# EAGLE design MainboardESP8266 (EAGLE 7.7.0)
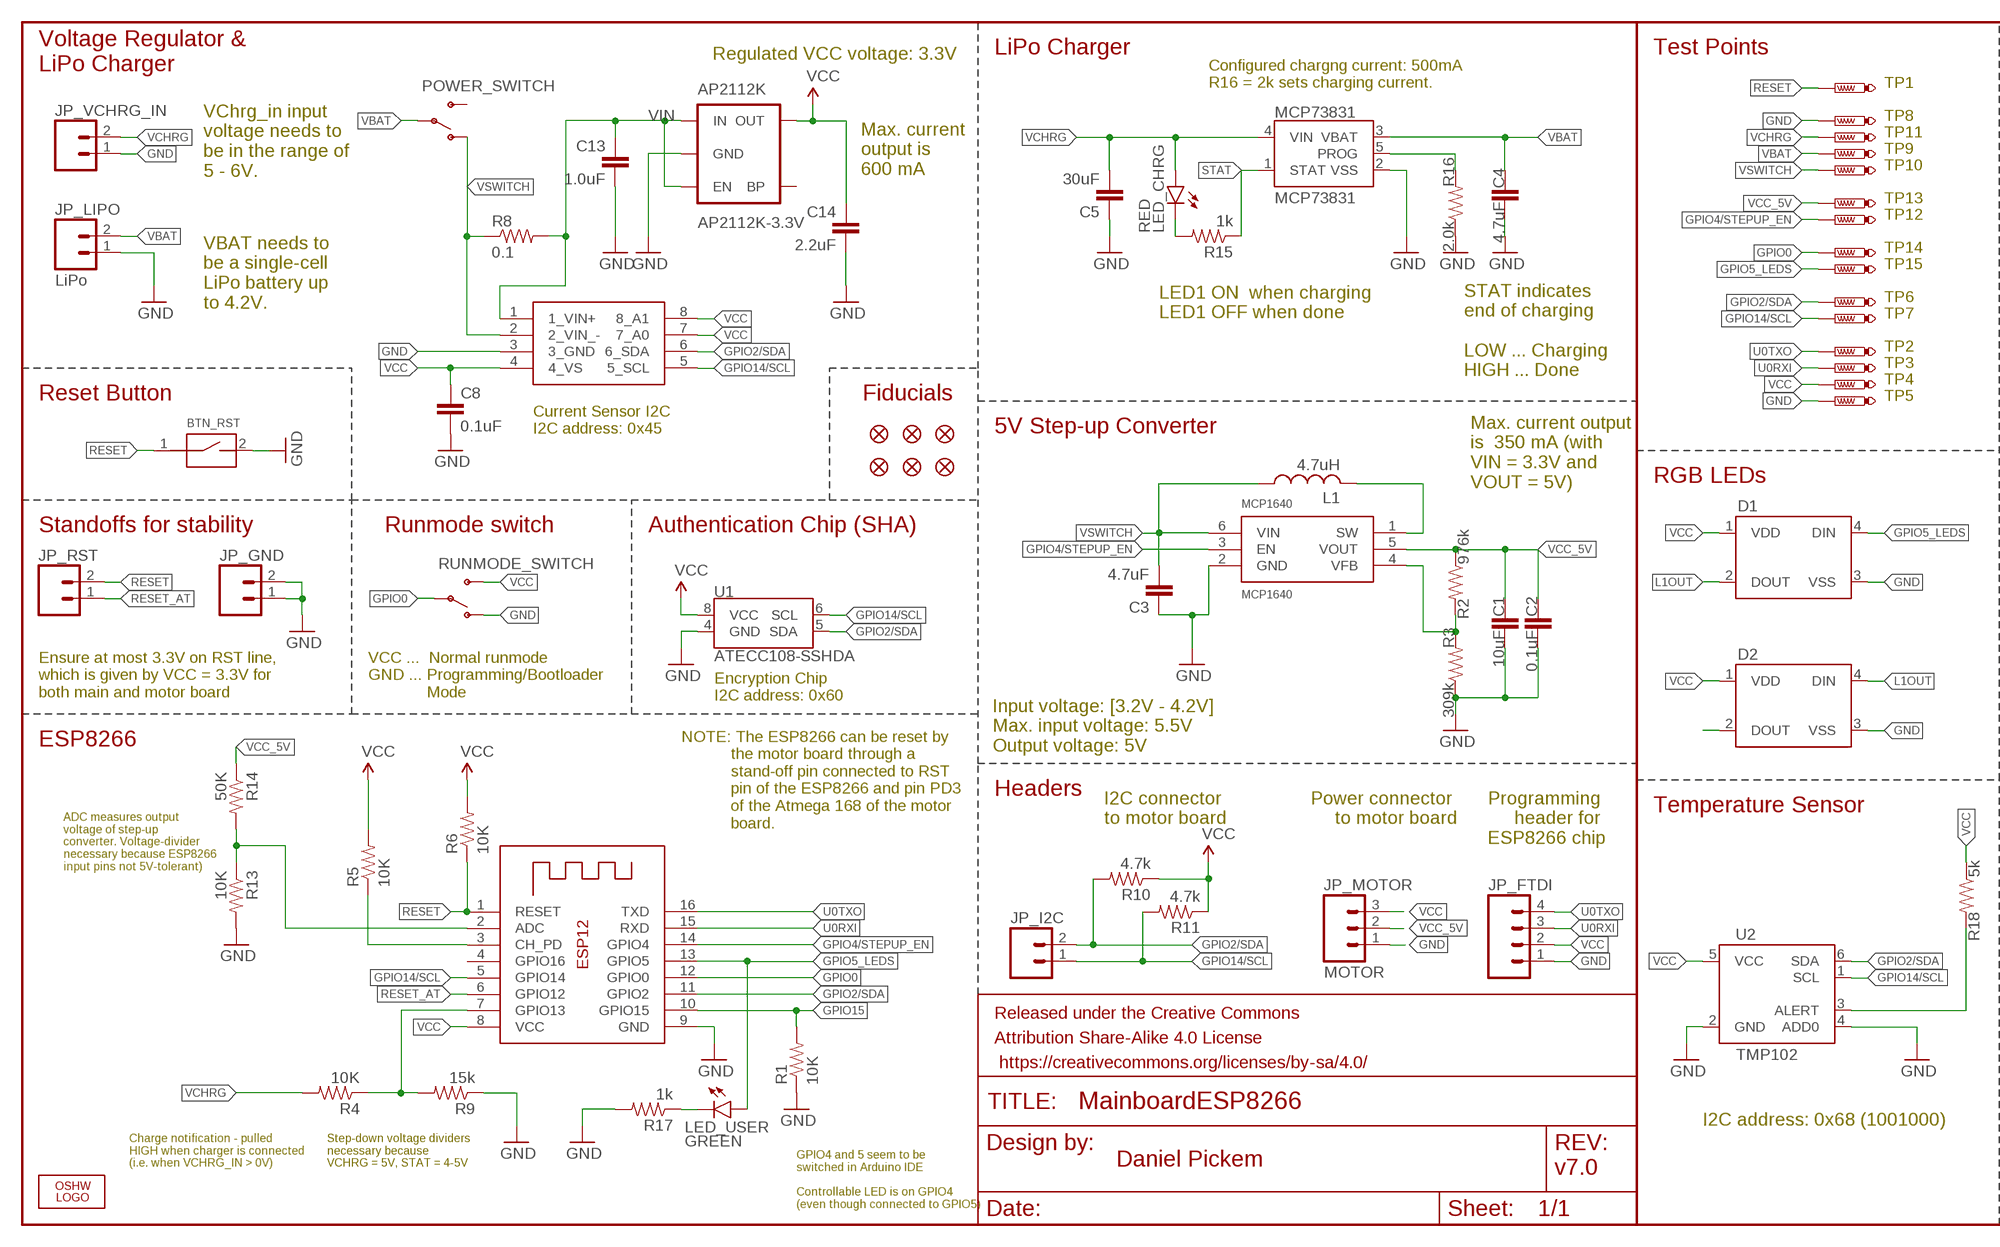
[diagram p0: schematic, sheet 1, part 1 of 2]
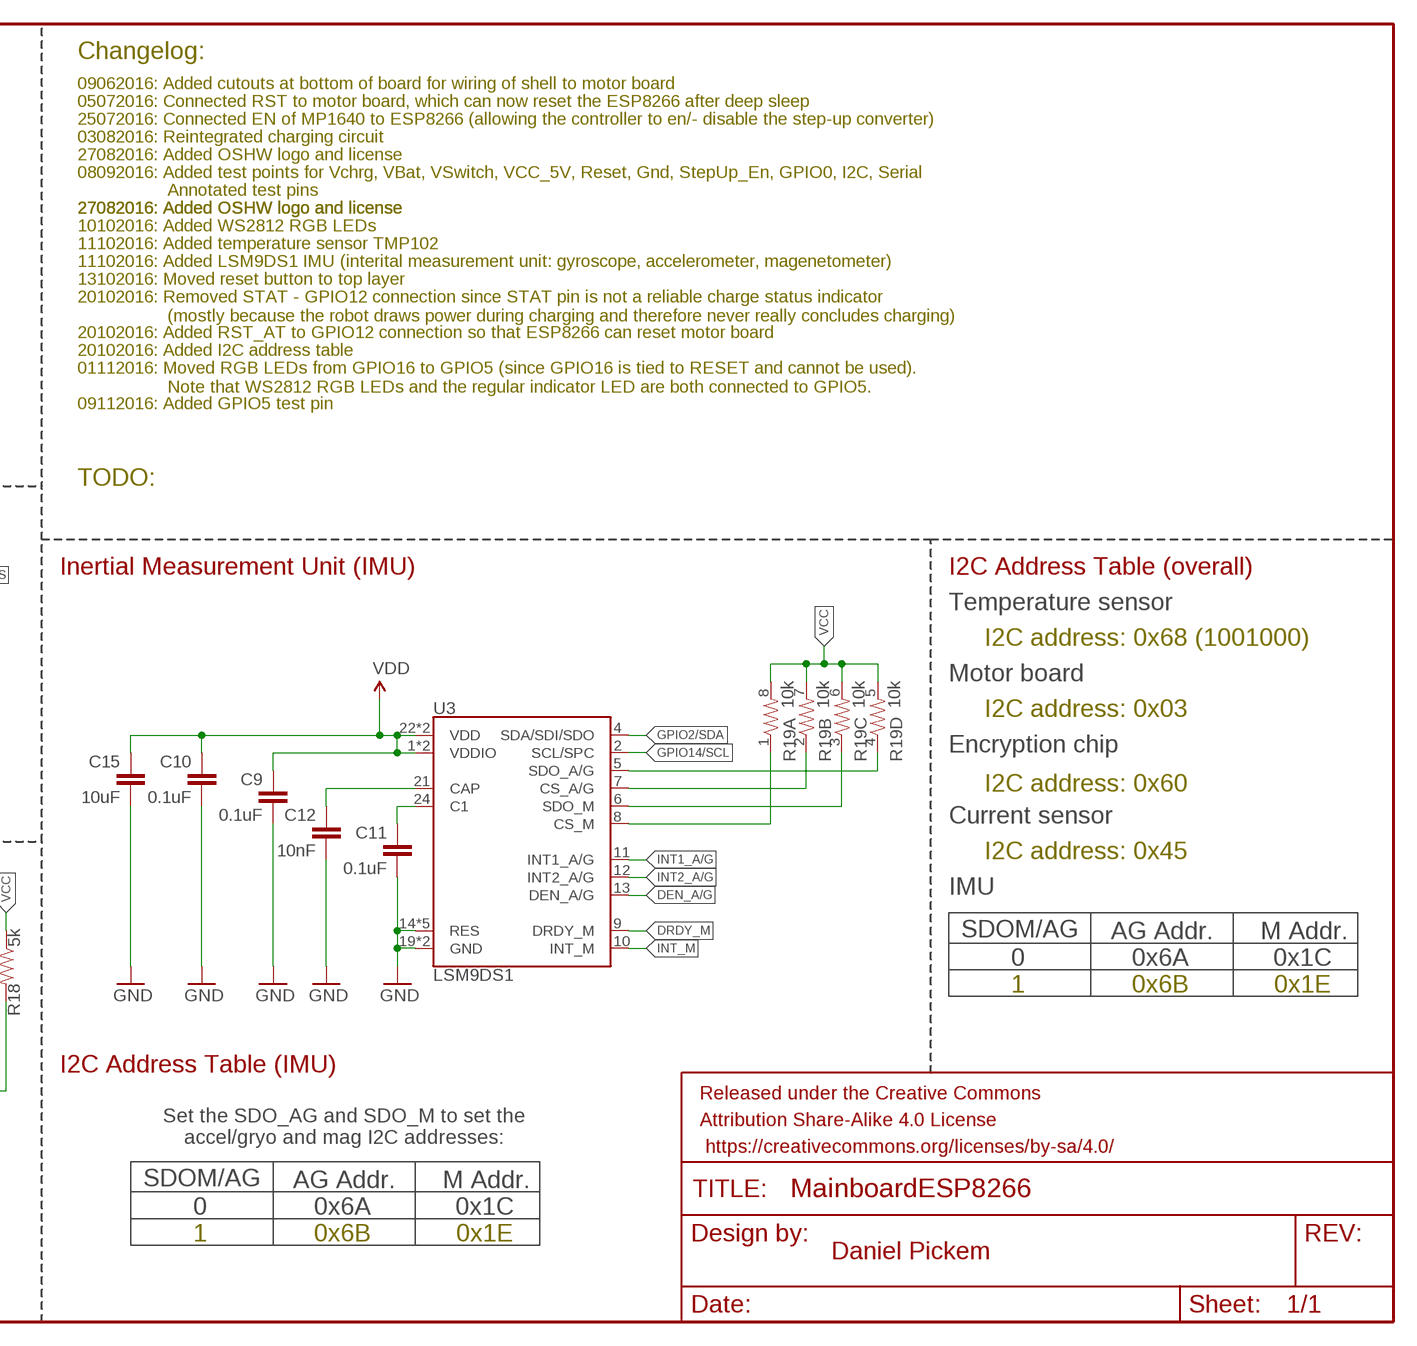
[diagram p1: schematic, sheet 1, part 2 of 2]

## Parts
AP2112K  AP2112K-3.3V  V_REG_LDOSMD  [SOT23-5]
BTN_RST  BUTTON_TACTILE_SLIM  [BUTTON_TACTILE_SLIM]
C1  10uF  4.7UF-6.3V-10%(0603)0603  [0603-CAP@1]
C2  0.1uF  4.7UF-6.3V-10%(0603)0603  [0603-CAP@1]
C3  4.7uF  1.0UF-16V-10%(0603)  [0603-CAP@1]
C4  4.7uF  4.7UF-6.3V-10%(0603)0603  [0603-CAP@1]
C5  30uF  10UF-6.3V-20%(1206)  [1206]
C8  0.1uF  1.0UF-16V-10%(0603)  [0603-CAP@1]
C9  0.1uF  0.1UF-25V(+80/-20%)(0603)  [0603-CAP]
C10  0.1uF  0.1UF-25V(+80/-20%)(0603)  [0603-CAP]
C11  0.1uF  0.1UF-25V(+80/-20%)(0603)  [0603-CAP]
C12  10nF  10NF/10000PF-50V-10%(0603)  [0603-CAP]
C13  1.0uF  1.0UF-25V-+80/-20(0805)  [0805]
C14  2.2uF  2.2UF-10V-20%(0603)  [0603-CAP@1]
C15  10uF  10UF-6.3V-20%(0603)  [0603-CAP]
D1  WS2812B  [WS2812B]
D2  WS2812B  [WS2812B]
ESP8266  ESP-12  [ESP-12-07]
FRAME1  FRAME-LETTER  [CREATIVE_COMMONS]
FRAME2  FRAME-LETTER  [CREATIVE_COMMONS]
INA219  INA219  [SOT-23-8]
JP1  FIDUCIAL1X2.5  [FIDUCIAL-1X2.5]
JP2  FIDUCIAL1X2.5  [FIDUCIAL-1X2.5]
JP3  FIDUCIAL1X2.5  [FIDUCIAL-1X2.5]
JP4  FIDUCIAL1X2.5  [FIDUCIAL-1X2.5]
JP5  FIDUCIAL1X2.5  [FIDUCIAL-1X2.5]
JP6  FIDUCIAL1X2.5  [FIDUCIAL-1X2.5]
JP_FTDI  M041X04_NO_SILK  [1X04_NO_SILK]
JP_GND  M021X02_NO_SILK  [1X02_NO_SILK]
JP_I2C  M02PTH  [1X02]
JP_LIPO  LiPo  M02PTH  [1X02]
JP_MOTOR  MOTOR  M03PTH  [1X03]
JP_RST  M021X02_NO_SILK  [1X02_NO_SILK]
JP_VCHRG_IN  M021X02_NO_SILK  [1X02_NO_SILK]
L1  4.7uH  INDUCTOR_NR3015  [INDUCTOR_NR3015]
LED_CHRG  RED  LED-YELLOW0603  [LED-0603]
LED_USER  GREEN  LED-GREEN0603  [LED-0603]
LOGO1  OSHW_LOGO_FILLX0100-NT  [OSHW_FILLX100_NOTEXT]
MCP1640  MCP1640  [SOT23-6-MCP1640]
MCP73831  MCP73831  [SOT23-5]
POWER_SWITCH  SWITCH-SPDT-SMD-A  [SWITCH-SPST-SMD-A]
R1  10K  10KOHM1/10W1%(0603)0603  [0603-RES@1]
R2  976k  2.0KOHM1/10W5%(0603)  [0603-RES@1]
R3  309k  2.0KOHM1/10W5%(0603)  [0603-RES@1]
R4  10K  10KOHM1/10W1%(0603)0603  [0603-RES@1]
R5  10K  10KOHM1/10W1%(0603)0603  [0603-RES@1]
R6  10K  10KOHM1/10W1%(0603)0603  [0603-RES@1]
R8  0.1  RESISTOR1206  [1206]
R9  15k  10KOHM1/10W1%(0603)0603  [0603-RES@1]
R10  4.7k  13KOHM1/10W1%(0603)  [0603]
R11  4.7k  13KOHM1/10W1%(0603)  [0603]
R13  10K  10KOHM1/10W1%(0603)0603  [0603-RES@1]
R14  50K  10KOHM1/10W1%(0603)0603  [0603-RES@1]
R15  1k  200OHM1/10W1%(0603)  [0603-RES@1]
R16  2.0k  2.0KOHM1/10W5%(0603)  [0603-RES@1]
R17  1k  200OHM1/10W1%(0603)  [0603-RES@1]
R18  5k  2.0KOHM1/10W5%(0603)  [0603-RES@1]
R19  10k  RESISTOR-ARRAY0603-ARV  [0603-ARV]
RUNMODE_SWITCH  SWITCH-SPDT-SMD-A  [SWITCH-SPST-SMD-A]
TP1  PTR1B1,27  [B1,27]
TP2  PTR1B1,27  [B1,27]
TP3  PTR1B1,27  [B1,27]
TP4  PTR1B1,27  [B1,27]
TP5  PTR1B1,27  [B1,27]
TP6  PTR1B1,27  [B1,27]
TP7  PTR1B1,27  [B1,27]
TP8  PTR1B1,27  [B1,27]
TP9  PTR1B1,27  [B1,27]
TP10  PTR1B1,27  [B1,27]
TP11  PTR1B1,27  [B1,27]
TP12  PTR1B1,27  [B1,27]
TP13  PTR1B1,27  [B1,27]
TP14  PTR1B1,27  [B1,27]
TP15  PTR1B1,27  [B1,27]
U1  ATECC108-SSHDA  [SO08]
U2  TMP102  [SOT563]
U3  LSM9DS1  [LGA24-8X4]

## Nets
ADC: ESP8266.2(ADC) R13.1 R14.2
C1: C11.1 U3.24(C1)
CAP: C12.1 U3.21(CAP)
CHIP_EN1: ESP8266.3(CH_PD) R5.1
CS_A/G: R19.2 U3.7(CS_A/G)
CS_M: R19.1 U3.8(CS_M)
DEN_A/G: U3.13(DEN_A/G)
DRDY_M: U3.9(DRDY_M)
GND: AP2112K.2(GND) BTN_RST.2 C1.2 C2.2 C3.1 C4.2 C5.1 C8.2 C9.2 C10.2 C11.2 C12.2 C13.2 C14.2 C15.2 D1.3(VSS) D2.3(VSS) ESP8266.9(GND) INA219.3(3_GND) JP_FTDI.1 JP_GND.1 JP_GND.2 JP_LIPO.1 JP_MOTOR.1 JP_VCHRG_IN.1 MCP1640.2(GND) MCP73831.2(VSS) R1.1 R3.1 R9.1 R13.2 R16.1 R17.2 RUNMODE_SWITCH.1(O) TP5.TP TP8.TP U1.4(GND) U2.2(GND) U2.4(ADD0) U3.14(RES) U3.15(RES) U3.16(RES) U3.17(RES) U3.18(RES) U3.19(GND) U3.20(GND)
GPIO0: ESP8266.12(GPIO0) RUNMODE_SWITCH.2(P) TP14.TP
GPIO2/SDA: ESP8266.11(GPIO2) INA219.6(6_SDA) JP_I2C.2 R10.2 TP6.TP U1.5(SDA) U2.6(SDA) U3.4(SDA/SDI/SDO)
GPIO4/STEPUP_EN: ESP8266.14(GPIO4) MCP1640.3(EN) TP12.TP
GPIO5_LEDS: D1.4(DIN) ESP8266.13(GPIO5) LED_USER.A TP15.TP
GPIO14/SCL: ESP8266.5(GPIO14) INA219.5(5_SCL) JP_I2C.1 R11.2 TP7.TP U1.6(SCL) U2.1(SCL) U3.2(SCL/SPC)
GPIO15: ESP8266.10(GPIO15) R1.2
INT1_A/G: U3.11(INT1_A/G)
INT2_A/G: U3.12(INT2_A/G)
INT_M: U3.10(INT_M)
L1OUT: D1.2(DOUT) D2.4(DIN)
L2OUT: D2.2(DOUT)
N$1: LED_CHRG.C R15.2
N$2: MCP73831.5(PROG) R16.2
N$3: MCP1640.4(VFB) R2.2 R3.2
N$5: ESP8266.7(GPIO13) R4.1 R9.2
N$10: R18.2 U2.3(ALERT)
N$12: L1.P$2 MCP1640.1(SW)
N$16: LED_USER.C R17.1
RESET: BTN_RST.1 ESP8266.1(RESET) JP_RST.2 R6.1 TP1.TP
RESET_AT: ESP8266.6(GPIO12) JP_RST.1
SDO_A/G: R19.4 U3.5(SDO_A/G)
SDO_M: R19.3 U3.6(SDO_M)
STAT: MCP73831.1(STAT) R15.1
U0RXI: ESP8266.15(RXD) JP_FTDI.3 TP3.TP
U0TXO: ESP8266.16(TXD) JP_FTDI.4 TP2.TP
VBAT: C4.1 JP_LIPO.2 MCP73831.3(VBAT) POWER_SWITCH.2(P) TP9.TP
VCC: AP2112K.5(OUT) C8.1 C9.1 C10.1 C14.1 C15.1 D1.1(VDD) D2.1(VDD) ESP8266.8(VCC) INA219.4(4_VS) INA219.7(7_A0) INA219.8(8_A1) JP_FTDI.2 JP_MOTOR.3 R5.2 R6.2 R10.1 R11.1 R18.1 R19.5 R19.6 R19.7 R19.8 RUNMODE_SWITCH.3(S) TP4.TP U1.8(VCC) U2.5(VCC) U3.1(VDDIO) U3.3(VDDIO) U3.22(VDD) U3.23(VDD) ; supply symbol labelled VDD
VCC_5V: C1.1 C2.1 JP_MOTOR.2 MCP1640.5(VOUT) R2.1 R14.1 TP13.TP
VCHRG: C5.2 JP_VCHRG_IN.2 LED_CHRG.A MCP73831.4(VIN) R4.2 TP11.TP
VIN: AP2112K.1(IN) AP2112K.3(EN) C13.1 INA219.1(1_VIN+) R8.2
VSWITCH: C3.2 INA219.2(2_VIN_-) L1.P$1 MCP1640.6(VIN) POWER_SWITCH.1(O) R8.1 TP10.TP
Unconnected: AP2112K.4(BP) ESP8266.4(GPIO16) POWER_SWITCH.3(S)

## Notes on the sheet
- Changelog:
- Regulated VCC voltage: 3.3V | LiPo Charger | Test Points
- Voltage Regulator &
  LiPo Charger
- 09062016: Added cutouts at bottom of board for wiring of shell to motor board
- Configured chargng current: 500mA
  R16 = 2k sets charging current.
- TP1 | 05072016: Connected RST to motor board, which can now reset the ESP8266 after deep sleep
- VChrg_in input
  voltage needs to
  be in the range of
  5 - 6V.
- 25072016: Connected EN of MP1640 to ESP8266 (allowing the controller to en/- disable the step-up converter)
- TP8 | 03082016: Reintegrated charging circuit
- TP11 | 27082016: Added OSHW logo and license
- TP9 | 08092016: Added test points for Vchrg, VBat, VSwitch, VCC_5V, Reset, Gnd, StepUp_En, GPIO0, I2C, Serial
- TP10 | Annotated test pins
- Max. current 
  output is 
  600 mA
- 27082016: Added OSHW logo and license | 27082016: Added OSHW logo and license | 27082016: Added OSHW logo and license
- TP13 | 10102016: Added WS2812 RGB LEDs
- TP12 | 11102016: Added temperature sensor TMP102
- VBAT needs to 
  be a single-cell 
  LiPo battery up
  to 4.2V.
- 11102016: Added LSM9DS1 IMU (interital measurement unit: gyroscope, accelerometer, magenetometer)
- TP14 | 13102016: Moved reset button to top layer
- TP15
- 20102016: Removed STAT - GPIO12 connection since STAT pin is not a reliable charge status indicator 
                    (mostly because the robot draws power during charging and therefore never really concludes charging)
- TP6 | 20102016: Added RST_AT to GPIO12 connection so that ESP8266 can reset motor board
- LED1 ON  when charging
  LED1 OFF when done
- TP7 | 20102016: Added I2C address table
- 01112016: Moved RGB LEDs from GPIO16 to GPIO5 (since GPIO16 is tied to RESET and cannot be used).
                    Note that WS2812 RGB LEDs and the regular indicator LED are both connected to GPIO5.
- TP2
- TP3 | 09112016: Added GPIO5 test pin
- STAT indicates 
  end of charging
  
  LOW ... Charging
  HIGH ... Done
- TP4
- Reset Button | Fiducials | TP5
- Current Sensor I2C
  I2C address: 0x45
- 5V Step-up Converter | TODO:
- RGB LEDs
- Max. current output 
  is  350 mA (with 
  VIN = 3.3V and
  VOUT = 5V)
- Standoffs for stability | Runmode switch | Authentication Chip (SHA) | Inertial Measurement Unit (IMU) | I2C Address Table (overall)
- Temperature sensor
- I2C address: 0x68 (1001000)
- Motor board
- I2C address: 0x03
- Ensure at most 3.3V on RST line,
  which is given by VCC = 3.3V for
  both main and motor board
- VCC ...  Normal runmode
  GND ... Programming/Bootloader 
               Mode
- Encryption chip
- Encryption Chip
  I2C address: 0x60
- I2C address: 0x60
- ESP8266
- Input voltage: [3.2V - 4.2V]
  Max. input voltage: 5.5V
  Output voltage: 5V
- Current sensor
- I2C connector 
  to motor board
- Power connector 
  to motor board
- Programming 
  header for 
  ESP8266 chip
- Headers | I2C address: 0x45
- Temperature Sensor
- IMU
- NOTE: The ESP8266 can be reset by
             the motor board through a 
             stand-off pin connected to RST 
             pin of the ESP8266 and pin PD3
             of the Atmega 168 of the motor
             board.
- SDOM/AG | AG Addr. | M Addr.
- ADC measures output
  voltage of step-up 
  converter. Voltage-divider
  necessary because ESP8266
  input pins not 5V-tolerant)
- 0 | 0x6A | 0x1C
- 1 | 0x6B | 0x1E
- I2C Address Table (IMU)
- Set the SDO_AG and SDO_M to set the
  accel/gryo and mag I2C addresses:
- SDOM/AG | AG Addr. | M Addr.
- I2C address: 0x68 (1001000) | 0 | 0x6A | 0x1C
- 1 | 0x6B | 0x1E
- Charge notification - pulled 
  HIGH when charger is connected
  (i.e. when VCHRG_IN > 0V)
- Step-down voltage dividers
  necessary because
  VCHRG = 5V, STAT = 4-5V
- Daniel Pickem | Daniel Pickem
- v7.0
- GPIO4 and 5 seem to be 
  switched in Arduino IDE 
  
  Controllable LED is on GPIO4
  (even though connected to GPIO5)

## Library data of the parts
AP2112K = SparkFun-PowerIC:V_REG_LDO: Voltage Regulator LDO Standard 150mA LDO voltage regulator in SOT-23 layout. Micrel part MIC5205. BP (by-pass) pin is used to lower output noise with 470pF cap.; PROD_ID: VREG-12457
BTN_RST = GRITSBot:BUTTON_TACTILE_SLIM: SWITCH TACTILE SPST-NO 0.05A 12V (Omron Electronics Inc-EMC Div B3U-1000P-B) Datasheet: http://www.components.omron.com/components/web/PDFLIB.nsf/0/2DD3893C7DD33E9E862572900079E9D6/$file/B3U_1110.pdf Purchase at: http://www.digikey.com/product-detail/en/B3U-1000P-B/SW1143DKR-ND/2567956
C1 C2 = SparkFun-Capacitors:4.7UF-6.3V-10%(0603): CAP-08280; PROD_ID: CAP-08280; VALUE: 4.7uF
C3 C8 = SparkFun-Capacitors:1.0UF-16V-10%(0603): CAP-00868; PROD_ID: CAP-00868; VALUE: 1.0uF
C4 = SparkFun-Capacitors:4.7UF-6.3V-10%(0603): CAP-08280; PROD_ID: CAP-08280
C5 = SparkFun-Capacitors:10UF-6.3V-20%(1206): CAP-10057 Ceramic; PROD_ID: CAP-10057; VALUE: 10uF
C9-C11 = SparkFun-Capacitors:0.1UF-25V(+80/-20%)(0603): CAP-00810 Ceramic Standard decoupling cap; PROD_ID: CAP-00810
C12 = SparkFun-Capacitors:10NF/10000PF-50V-10%(0603): CAP-00867; PROD_ID: CAP-00867
C13 = SparkFun-Capacitors:1.0UF-25V-+80/-20(0805): CAP-11625; PROD_ID: CAP-11625
C14 = SparkFun-Capacitors:2.2UF-10V-20%(0603): CAP-07888; PROD_ID: CAP-07888
C15 = SparkFun-Capacitors:10UF-6.3V-20%(0603): CAP-11015; PROD_ID: CAP-11015
D1 D2 = SparkFun-LED:WS2812B: WS2812B - Intelligent control LED integrated light source Technical Specifications: Power Supply Voltage (VDD): 3.5 to 5.3 V Input Voltage (VI): -0.5 to VDD+0.5 V Operating Junction Temperature (Topt): -25°C to +80°C Storage Temperature Range (Tstg): -55°C to +150°C; PROD_ID: DIO-12503
ESP8266 = GRITSBot:ESP-12
FRAME1 FRAME2 = GRITSBot:FRAME-LETTER: Schematic Frame Standard 8.5x11 US Letter frame
INA219 = GRITSBot:INA219: TI Zero-Drift, Bi-Directional CURRENT/POWER MONITOR with I2C Interface The INA219 is a high-side current shunt and power monitor with an I2C interface. The INA219 monitors bothshunt drop and supply voltage. Datasheet: http://www.ti.com/lit/ds/symlink/ina219.pdf
JP1-JP6 = abes:FIDUCIAL: Fiducial Alignment Points Various fiducial points for machine vision alignment.
JP_FTDI = SparkFun-Connectors:M04: Header 4 Standard 4-pin 0.1" header. Use with straight break away headers (SKU : PRT-00116), right angle break away headers (PRT-00553), swiss pins (PRT-00743), machine pins (PRT-00117), and female headers (PRT-00115). Molex polarized connector foot print use with SKU : PRT-08231 with associated crimp pins and housings. 1MM SMD Version SKU: PRT-10208; PROD_ID: CONN-09696
JP_GND JP_I2C JP_LIPO JP_RST JP_VCHRG_IN = SparkFun-Connectors:M02: Standard 2-pin 0.1" header. Use with - straight break away headers ( PRT-00116) - right angle break away headers (PRT-00553) - swiss pins (PRT-00743) - machine pins (PRT-00117) - female headers (PRT-00115) Molex polarized connector foot print use with: PRT-08233 with associated crimp pins and housings. 2.54_SCREWTERM for use with PRT-10571. 3.5mm Screw Terminal footprints for PRT-08084 5mm Screw Terminal footprints for use with PRT-08433
JP_MOTOR = SparkFun-Connectors:M03: Header 3 Standard 3-pin 0.1" header. Use with straight break away headers (SKU : PRT-00116), right angle break away headers (PRT-00553), swiss pins (PRT-00743), machine pins (PRT-00117), and female headers (PRT-00115). Molex polarized connector foot print use with SKU : PRT-08232 with associated crimp pins and housings.
L1 = LowPowerLab:INDUCTOR
LED_CHRG = SparkFun-LED:LED-YELLOW: Yellow SMD LEDs LilyPad 1206- DIO-09909 0603- DIO-09003; PROD_ID: DIO-09003
LED_USER = SparkFun-LED:LED-GREEN: Various green LEDs Green LEDs used in SFE Production 0603- DIO-00821 LARGE- DIO-00862 LILYPAD- DIO-09910; PROD_ID: DIO-00821
LOGO1 = OSHW:OSHW_LOGO_FILL
MCP1640 = GRITSBot:MCP1640: 0.65V Start-up Synchronous Boost Regulator with True Output Disconnect or Input/Output Bypass Option The MCP1640/B/C/D is a compact, high-efficiency, fixed frequency, synchronous step-up DC-DC converter. It provides an easy-to-use power supply solution for applications powered by either one-cell, two-cell, or three-cell alkaline, NiCd, NiMH, one-cell Li-Ion or Li-Polymer batteries. See http://www.mouser.com/ds/2/268/22234A-71395.pdf
MCP73831 = SparkFun-PowerIC:MCP73831: Miniature single cell, fully integrated Li-Ion, Li-polymer charge management controller http://ww1.microchip.com/downloads/en/DeviceDoc/21984a.pdf IC-09995; PROD_ID: IC-09995
POWER_SWITCH RUNMODE_SWITCH = SparkFun-Electromechanical:SWITCH-SPDT: SPDT Switch Simple slide switch, Spark Fun Electronics SKU : COM-00102 DPDT SMT slide switch, AYZ0202, SWCH-08179; PROD_ID: SWCH-10651
R1 R4-R6 R13 = SparkFun-Resistors:10KOHM1/10W1%(0603): RES-00824; PROD_ID: RES-00824
R2 R3 R18 = SparkFun-Resistors:2.0KOHM1/10W5%(0603): RES-08296; PROD_ID: RES-08296; VALUE: 2.0k
R8 = SparkFun-Resistors:RESISTOR: Resistor Basic schematic elements and footprints for 0603, 1206, and PTH resistors.
R9 R14 = SparkFun-Resistors:10KOHM1/10W1%(0603): RES-00824; PROD_ID: RES-00824; VALUE: 10K
R10 R11 = SparkFun-Resistors:13KOHM1/10W1%(0603): RES-09571; PROD_ID: RES-09571; VALUE: 13k
R15 R17 = SparkFun-Resistors:200OHM1/10W1%(0603): RES-08220; PROD_ID: RES-08220; VALUE: 200
R16 = SparkFun-Resistors:2.0KOHM1/10W5%(0603): RES-08296; PROD_ID: RES-08296
R19 = SparkFun-Passives:RESISTOR-ARRAY: Array Chip Resistor Source: RS Component / Phycomp
TP1-TP15 = testpad:PTR1: TEST PIN
U1 = GRITSBot:ATECC108: Atmel ATECC108 CryptoAuthentication Chip
U2 = SparkFun-Sensors:TMP102: I2C degC temp sensor; PROD_ID: IC-09303
U3 = LSM9DS1_temp:LSM9DS1: LSM9DS1 3D accelerometer, gyroscope & magnetometer The LSM9DS1 is a system-in-package featuring a 3D digital linear acceleration sensor, a 3D digital angular rate sensor, and a 3D digital magnetic sensor. The LSM9DS1 has a linear acceleration full scale of ±2g/±4g/±8/±16 g, a magnetic field full scale of ±4/±8/±12/±16 gauss and an angular rate of ±245/±500/±2000 dps. The LSM9DS1 includes an I2 C serial bus interface supporting standard and fast mode (100 kHz and 400 kHz) and an SPI serial standard interface. Magnetic, accelerometer and gyroscope sensing can be enabled or set in power-down mode separately for smart power management. The LSM9DS1 is available in a plastic land grid array package (LGA) and it is guaranteed to operate over an extended temperature range from -40 °C to +85 °C.; PROD_ID: IC-12536

## Board
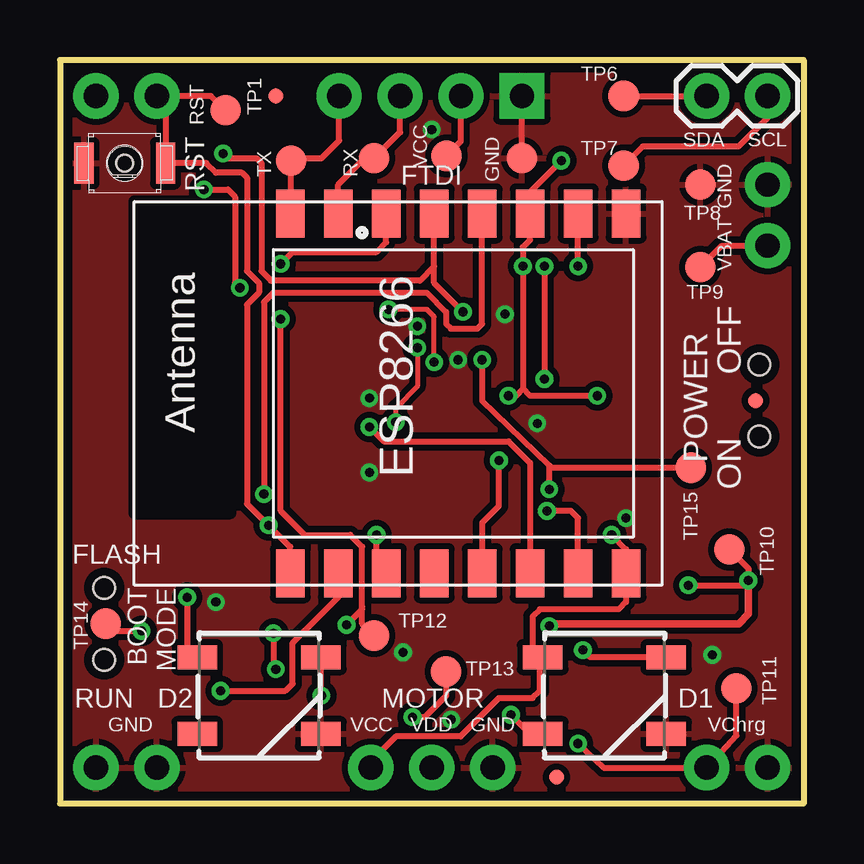
[diagram p2: board, top side]
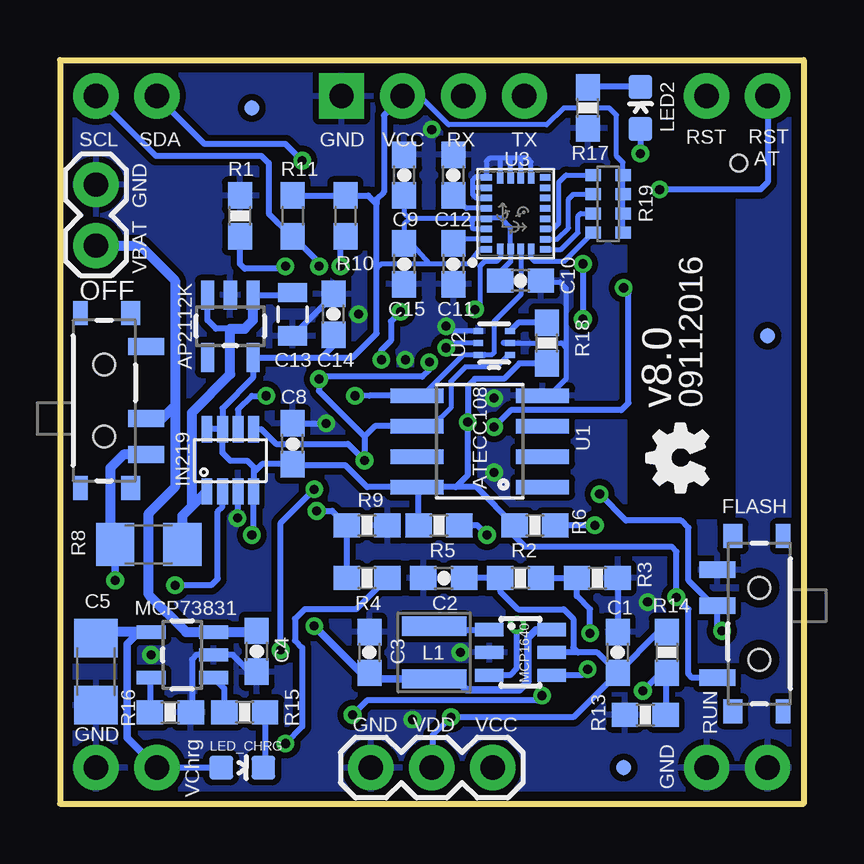
[diagram p3: board, bottom side, seen from below]

Size 31 x 31 mm. Coordinates in mm from the lower left corner, seen from the top.
Outline: 31,31 0,31 0,0 31,0 31,31
Copper layers (1*16): Top 0.0356mm / dielectric 1.5011mm / Bottom 0.0356mm
Design rules "LaenPCBOrder": minimum track width 6mil, minimum drill 13mil, track to track 6mil, track to pad 6mil, pad to pad 6mil, via to via 6mil, smd to smd 6mil, copper to edge 15mil, drill to drill 6mil, minimum pad ring 7mil, minimum via ring 7mil, stop-mask expansion 3mil, vias tented up to drill 40mil, thermal gap 10mil

### Footprints (pad centres in the part's own frame; a part is rotated, then mirrored left to right if it is on the bottom)
SOT23-5 = smd 0.55 x 1.2: 1 -0.95,-1.3; 2 0,-1.3; 3 0.95,-1.3; 4 0.95,1.3; 5 -0.95,1.3
BUTTON_TACTILE_SLIM = smd 0.8 x 1.7: 1 -1.7,0; 2 1.7,0 | hole 0.7: 0,0
0603-CAP@1 = smd 1.1 x 1: 1 -0.85,0; 2 0.85,0
1206 = smd 1.6 x 1.8: 1 -1.4,0; 2 1.4,0
0603-CAP = smd 1.1 x 1: 1 -0.85,0; 2 0.85,0
0805 = smd 0.8 x 1.2: 1 -0.9,0; 2 0.9,0
WS2812B = smd 1.651 x 1: 1 -2.577,1.6; 2 -2.577,-1.6; 3 2.577,-1.6; 4 2.577,1.6
ESP-12-07 = smd 2 x 1.2: 1 -7.5,4.5; 2 -7.5,2.5; 3 -7.5,0.5; 4 -7.5,-1.5; 5 -7.5,-3.5; 6 -7.5,-5.5; 7 -7.5,-7.5; 8 -7.5,-9.5; 9 7.5,-9.5; 10 7.5,-7.5; 11 7.5,-5.5; 12 7.5,-3.5; 13 7.5,-1.5; 14 7.5,0.5; 15 7.5,2.5; 16 7.5,4.5
SOT-23-8 = smd 0.45 x 1.1: 1 -0.975,-1.3; 2 -0.325,-1.3; 3 0.325,-1.3; 4 0.975,-1.3; 5 0.975,1.3; 6 0.325,1.3; 7 -0.325,1.3; 8 -0.975,1.3
FIDUCIAL-1X2.5 = smd 0.635 x 0.635: 1 0,0
1X04_NO_SILK = drill 1.016 pad 1.88 square: 1 0,0 | drill 1.016 pad 1.88: 2 2.54,0; 3 5.08,0; 4 7.62,0
1X02_NO_SILK = drill 1.016 pad 1.88: 1 0,0; 2 2.54,0
1X02 = drill 1.016 pad 1.88: 1 0,0; 2 2.54,0
1X03 = drill 1.016 pad 1.88: 1 0,0; 2 2.54,0; 3 5.08,0
INDUCTOR_NR3015 = smd 0.8 x 2.7: P$1 -1.1,0; P$2 1.1,0
LED-0603 = smd 1 x 1: A 0,-0.877; C 0,0.877
SOT23-6-MCP1640 = smd 0.55 x 1.2: 1 -0.95,-1.3; 2 0,-1.3; 3 0.95,-1.3; 4 0.95,1.3; 5 0,1.3; 6 -0.95,1.3
SWITCH-SPST-SMD-A = smd 0.7 x 1.5: 1 -2.25,-1.75; 2 -0.75,-1.75; 3 2.25,-1.75 | smd 1 x 0.6: GND1 -3.65,1; GND3 3.65,1 | smd 1 x 0.8: GND2 -3.65,-1.1; GND4 3.65,-1.1 | hole 0.9: -1.5,0; 1.5,0
0603-RES@1 = smd 1.1 x 1: 1 -0.85,0; 2 0.85,0
0603 = smd 1.1 x 1: 1 -0.85,0; 2 0.85,0
0603-ARV = smd 0.5 x 0.65: 1 -1.2,-0.625; 2 -0.4,-0.625; 3 0.4,-0.625; 4 1.2,-0.625; 5 1.2,0.625; 6 0.4,0.625; 7 -0.4,0.625; 8 -1.2,0.625
B1,27 = smd 1.27 x 1.27: TP 0,0
SO08 = smd 0.61 x 2.21: 1 -1.905,-2.616; 2 -0.635,-2.616; 3 0.635,-2.616; 4 1.905,-2.616; 5 1.905,2.616; 6 0.635,2.616; 7 -0.635,2.616; 8 -1.905,2.616
SOT563 = smd 0.25 x 0.4: 1 -0.5,-0.66; 2 0,-0.66; 3 0.5,-0.66; 4 0.5,0.66; 5 0,0.66; 6 -0.5,0.67
LGA24-8X4 = smd 0.27 x 0.45: 1 -1.505,1.225; 6 -1.505,-1.225; 7 -1.075,-1.225; 8 -0.645,-1.225; 9 -0.215,-1.225; 10 0.215,-1.225; 11 0.645,-1.225; 12 1.075,-1.225; 13 1.505,-1.225; 18 1.505,1.225; 19 1.075,1.225; 20 0.645,1.225; 21 0.215,1.225; 22 -0.215,1.225; 23 -0.645,1.225; 24 -1.075,1.225 | smd 0.45 x 0.27: 2 -1.475,0.645; 3 -1.475,0.215; 4 -1.475,-0.215; 5 -1.475,-0.645; 14 1.475,-0.645; 15 1.475,-0.215; 16 1.475,0.215; 17 1.475,0.645

### Placement (x,y rotation side)
AP2112K  23.9,19.9 180 bottom
BTN_RST  2.7,26.7 180 top
C1  7.75,6.3 90 bottom
C2  15,9.4 180 bottom
C3  18.1,6.3 270 bottom
C4  22.8,6.35 270 bottom
C5  29.5,5.5 90 bottom
C8  21.3,15 90 bottom
C9  16.65,26.2 90 bottom
C10  11.8,21.8 0 bottom
C11  14.6,22.5 270 bottom
C12  14.6,26.2 90 bottom
C13  21.3,20.4 270 bottom
C14  19.6,20.4 90 bottom
C15  16.65,22.5 270 bottom
D1  22.7,4.5 0 top
D2  8.3,4.5 0 top
ESP8266  14.1,17.1 90 top
FRAME1  30.1,0.1 0 bottom
FRAME2  0,0 0 top
INA219  23.9,14.31 0 bottom
JP1  1.5,19.5 0 bottom
JP2  23,29 0 bottom
JP3  7.5,1.5 0 bottom
JP4  9,29.5 0 top
JP5  20.7,1.1 0 top
JP6  29,16.8 0 top
JP_FTDI  19.26,29.5 180 top
JP_GND  1.5,1.5 0 top
JP_I2C  29.5,29.5 180 top
JP_LIPO  29.5,25.8 270 bottom
JP_MOTOR  18.04,1.5 0 bottom
JP_RST  1.5,29.5 0 top
JP_VCHRG_IN  29.5,1.5 180 top
L1  15.4,6.3 90 bottom
LED_CHRG  23.4,1.5 270 bottom
LED_USER  6.8,29 0 bottom
LOGO1  4,13 90 bottom
MCP1640  11.8,6.3 270 bottom
MCP73831  25.9,6.2 90 bottom
POWER_SWITCH  29.15,16.8 90 bottom
R1  23.5,24.5 270 bottom
R2  11.8,9.4 0 bottom
R3  8.6,9.4 180 bottom
R4  18.2,9.4 0 bottom
R5  15.2,11.6 180 bottom
R6  11.2,11.6 180 bottom
R8  27.3,10.8 0 bottom
R9  18.2,11.6 180 bottom
R10  19.1,24.5 270 bottom
R11  21.3,24.5 270 bottom
R13  6.6,3.7 180 bottom
R14  5.7,6.3 270 bottom
R15  23.3,3.8 0 bottom
R16  26.4,3.8 180 bottom
R17  9,29 270 bottom
R18  10.7,19.2 90 bottom
R19  8.15,25 270 bottom
RUNMODE_SWITCH  1.85,7.5 270 bottom
TP1  6.9,28.9 0 top
TP2  9.64,26.8 0 top
TP3  13.1,26.9 0 top
TP4  16.12,27 0 top
TP5  19.26,26.9 0 top
TP6  23.5,29.5 0 top
TP7  23.5,26.6 0 top
TP8  26.7,25.8 0 top
TP9  26.7,22.36 0 top
TP10  27.9,10.6 0 top
TP11  28.2,4.8 0 top
TP12  13.1,7 0 top
TP13  16.1,5.5 0 top
TP14  1.9,7.5 0 top
TP15  26.3,14 0 top
U1  13.5,15.1 90 bottom
U2  12.9,19.2 90 bottom
U3  12,24.6 90 bottom

### Tracks (layer width: path | path; a pad name or v marks a point on that pad's centre or on a via)
ADC  (via drill 0.38)
  Top 0.254: v6.7,4.7 9.4,4.7 9.7,5 9.7,6.7 11.6,8.6 ESP8266.2
  Bottom 0.254: R13.1 5.75,5.4 R14.2 5.95,5.45 v6.7,4.7
C1
  Bottom 0.203: U3.24 14.43,23.52 C11.1
CAP
  Bottom 0.203: U3.21 14.06,24.82 C12.1
CHIP_EN1  (via drill 0.38)
  Top 0.254: ESP8266.3 13.2,10 v13.2,11.2
  Bottom 0.254: v13.2,11.2 13.6,11.6 R5.1
CS_A/G
  Bottom 0.203: U3.7 10.28,23.52 9.8,24 9.8,25.2 9.6,25.4 R19.2
CS_M
  Bottom 0.203: R19.1 9.9,26.2 10.2,25.9 10.2,24.2 10.45,23.95 U3.8
GND  (via drill 0.38)
  Top 0.254: TP5.TP JP_FTDI.1
  Bottom 0.203: U2.2 10.1,19.2 9.9,19 | C10.2 10.95,21.75 10.15,21.75 9.9,21.5 9.9,19 | 12.68,26.11 U3.17 12.64,26.84 12.7,26.9 | 9.9,19 9.9,17.7 10.6,17 U1.4 | U2.4 14.7,19.7 v14.9,19.9 | U3.14 11.36,26.75 11.5,26.9 11.8,26.9 | 11.8,26.9 12.2,26.9 | U3.15 11.79,26.89 11.8,26.9 | U3.16 12.21,26.89 12.2,26.9 | 13.8,25.7 13.8,26 13.7,26.11 U3.18 13.22,26.77 13.1,26.9 12.7,26.9 | 13.8,25.7 13.8,25.4 13.64,25.25 U3.20 | U3.19 13.78,25.68 13.8,25.7 | 12.2,26.9 12.7,26.9
  Bottom 0.254: C8.2 v19.9,15.85 | v23.6,11.9 23.57,11.93 INA219.3 | C1.2 R3.1 7.5,9.4 | C14.2 19.6,21.2 C13.2 | R16.1 25.5,3.85 25.5,6 25.3,6.2 MCP73831.2 23.8,6.2 23.05,5.45 C4.2 | U2.2 12.5,19.2
  other vias: 18.55,20.4 12.9,13.8 6.5,8.4 27.2,6.2 14.3,6.3 16.3,3.5 15.5,28.1 12.9,16.9 16.6,18.5
  pour Top (isolate 0.254): 31,31 0,31 0,0 31,0
  pour Bottom (isolate 0.254): 31,31 0,31 0,0 31,0
GPIO0  (via drill 0.38)
  Top 0.254: ESP8266.12 17.6,20 17.4,19.8 16.3,19.8 16.1,20 16.1,20.5 15.3,21.3 8.9,21.3 8.5,20.9 v8.5,12.9 | TP14.TP 2.2,7.2 v3.4,7.2
  Bottom 0.254: v3.4,7.2 3.6,7.4 RUNMODE_SWITCH.2 3.75,8.25 4.8,9.3 4.8,11.5 5.1,11.8 7.4,11.8 v8.5,12.9
GPIO2/SDA  (via drill 0.38)
  Top 0.254: 19.3,17.3 v19.3,22.4 19.3,23.2 19.6,23.5 ESP8266.11 19.6,25.5 v20.9,26.8 | v22.4,17 19.6,17 19.3,17.3 | v18.7,17 19,17 19.3,17.3 | TP6.TP JP_I2C.2
  Bottom 0.203: U3.4 11.79,21.21 12.9,20.1 12.9,18.8 13,18.7 U2.6 14.2,18.7 15.89,17 U1.5
  Bottom 0.254: v22.4,17 23,17 23.57,16.43 INA219.6 | v18.7,17 18.09,17 U1.5 16.1,17.02 | JP_I2C.2 24.96,27.5 21.6,27.5 v20.9,26.8 | 19.3,24.05 R10.2 19.1,23.4 19.3,23.2 v19.3,22.4 | U2.6 13.3,18.7
GPIO4/STEPUP_EN  (via drill 0.38)
  Top 0.254: 12.6,8.1 v11.95,7.45 12.1,7.6 | 12.6,8.1 12.6,8.2 12.6,10.7 12.1,11.2 10.2,11.2 9.2,12.2 v9.2,20.2 | ESP8266.14 13.6,23.4 13.2,23 9.7,23 v9.2,22.5 | TP12.TP 12.6,7.5 12.6,8.1
  Bottom 0.254: v11.95,7.45 11.95,5.65 12.25,5.35 MCP1640.3 | v9.2,22.5 v9.2,20.2
GPIO5_LEDS  (via drill 0.38)
  Top 0.254: 15.6,22.4 15.6,21.7 v16.8,20.5 | 15.6,22.4 ESP8266.13 15.7,24.6 | v6.8,27.1 7,26.9 8.2,26.9 8.4,26.7 8.4,22.2 8.8,21.8 15,21.8 15.6,22.4 | D1.4 22.1,6.1 v21.8,6.4 | v20.4,13.1 20.4,14.1 | 20.4,14.1 17.6,16.8 v17.6,18.5 | TP15.TP 20.5,14 20.4,14.1
  Bottom 0.254: LED_USER.A 6.98,28.12 6.8,27.95 v6.8,27.1 | v21.8,6.4 21.8,11.7 v20.4,13.1 | v16.8,20.5 17.2,20.1 17.2,19.3 17.6,18.9 v17.6,18.5
GPIO14/SCL  (via drill 0.38)
  Top 0.203: v15.6,18.4 15.6,20.3 15.3,20.6 v13.7,20.6
  Top 0.254: v20.2,22.4 v20.2,17.7 | v18.3,14.3 18.3,12.4 17.6,11.7 ESP8266.5 | TP7.TP 24.3,27.4 28.3,27.4 29.5,28.6 JP_I2C.1
  Bottom 0.203: U3.2 12.64,22.75 12.8,22.6 13.3,22.6 13.5,22.4 13.5,20.8 v13.7,20.6 | U2.1 12.3,18.7 12.8,18.2 14.1,18.2 14.7,17.6 14.7,16.5 15.46,15.73 U1.6
  Bottom 0.254: 18.3,15.3 v18.3,14.3 19,15 22,15 22.61,15.61 INA219.5 | U1.6 17.86,15.73 18.3,15.3 | 18.3,15.3 20.2,17.2 v20.2,17.7 20.1,17.8 15.9,17.8 15.6,18.1 v15.6,18.4 | JP_I2C.1 27,27 22.6,27 22.3,26.7 22.3,24.6 21.95,24.25 R11.2 20.2,22.55 v20.2,22.4
GPIO15  (via drill 0.38)
  Top 0.254: v21.6,22.4 ESP8266.10
  Bottom 0.254: v21.6,22.4 21.7,22.3 23.3,22.3 23.5,22.5 R1.2
L1OUT  (via drill 0.38)
  Top 0.254: v10.9,4.5 10.88,4.52 D2.4 | 19.7,2.9 D1.2 19.6,2.9 v18.8,3.7
  Bottom 0.254: v10.9,4.5 11.1,4.3 18.2,4.3 v18.8,3.7
N$1
  Bottom 0.254: R15.2 22.45,1.57 LED_CHRG.C
N$2
  Bottom 0.254: MCP73831.5 27.15,5.2 27.25,5.1 R16.2
N$3  (via drill 0.38)
  Top 0.254: v8.9,7.1 8.9,5.7 v9,5.6
  Bottom 0.254: R2.2 R3.2 | 10.45,5.3 MCP1640.4 9.25,5.35 v9,5.6 | R3.2 9.5,9.35 | v8.9,7.1 8.9,8.1 9.45,8.65 R3.2
N$5  (via drill 0.38)
  Top 0.254: ESP8266.7 21.6,11.9 21.3,12.2 v20.3,12.2
  Bottom 0.254: R4.1 R9.2 19.65,12.2 v20.3,12.2
N$10
  Bottom 0.254: R18.2 11.89,20.05 U2.3
N$12
  Bottom 0.254: L1.P$2 15.25,7.25 MCP1640.1
N$16
  Bottom 0.254: LED_USER.C 8.97,29.88 R17.1
RESET  (via drill 0.38)
  Top 0.254: ESP8266.1 9.6,10.7 v8.7,11.6 7.8,12.5 7.8,20.8 8.3,21.3 8.3,21.7 7.8,22.2 7.8,26.1 7.6,26.3 6.5,26.3 6.1,26.7 BTN_RST.1 4.4,29.14 JP_RST.2 6.3,29.5 TP1.TP
  Bottom 0.254: v8.7,11.6 R6.1
RESET_AT  (via drill 0.38)
  Top 0.254: v6,25.6 7,25.6 7.3,25.3 7.3,21.7 v7.5,21.5 | v12.9,15.7 13.5,15.1 18.7,15.1 19.6,14.2 ESP8266.6
  Bottom 0.254: JP_RST.1 1.5,25.9 1.8,25.6 v6,25.6 | v7.5,21.5 7.3,21.3 7.3,16.7 7.6,16.4 12.2,16.4 v12.9,15.7
SDO_A/G
  Bottom 0.203: U3.5 11.36,22.75 11.2,22.6 10,22.6 9.22,23.38 R19.4
SDO_M
  Bottom 0.203: U3.6 10.11,23.09 9.4,23.8 9.4,24.5 9.3,24.6 R19.3 8.9,24.6
STAT
  Bottom 0.254: MCP73831.1 24.15,4.8 R15.1
U0RXI
  Top 0.254: 14.2,29.48 JP_FTDI.3 14.18,27.98 TP3.TP 12.7,26.9 11.6,25.8 ESP8266.15
U0TXO
  Top 0.254: ESP8266.16 9.64,24.64 TP2.TP 9.74,26.9 10.9,26.9 11.64,27.64 JP_FTDI.4
VBAT
  Top 0.254: JP_LIPO.2 28.3,23.26 27.8,23.26 27.6,23.26 TP9.TP
  Bottom 0.406: JP_LIPO.2 27.66,23.26 26.2,21.8 26.2,16.6 | 26.2,16.6 26.2,13.2 27.3,12.1 27.3,8.7 25.75,7.15 MCP73831.3 22.85,7.15 C4.1 | POWER_SWITCH.2 26.75,16.05 26.2,16.6
VCC  (via drill 0.38)
  Top 0.203: v14.9,19 14.9,17.4 14,16.5 v14,15.9
  Top 0.254: v23,11.2 23.6,10.6 ESP8266.8 23.6,8.4 23.3,8.1 20,8.1 19.7,7.8 19.7,6.52 D1.1 20,5.98 20,4.7 19.7,4.4 18.3,4.4 16.7,2.8 14,2.8 12.96,1.76 JP_MOTOR.3 | v5.3,8.6 5.3,6.52 D2.1 | JP_FTDI.2 16.7,29.48 16.7,27.6 16.12,27.02 TP4.TP
  Bottom 0.203: U3.1 13.51,23.09 14,22.5 15.6,22.5 | 15.6,22.5 17.6,22.5 17.8,22.3 | C10.1 12.65,22.15 12.21,22.59 U3.3 12.21,24.02 12.6,24.4 U3.22 13.9,24.39 | 15.6,22.5 16.5,23.5 C15.1 16.65,24.15 16.41,24.39 | 13.9,24.39 16.41,24.39 | R19.8 R19.7 R19.6 R19.5 7.53,26.73 7.8,27 7.8,28.7 8.1,29 10,29 10.7,28.3 14.8,28.3 16,29.5 JP_FTDI.2 | U2.5 14.7,19.2 v14.9,19 | C9.1 16.65,24.62 16.41,24.39 | U3.23 13.76,23.95 13.8,24 13.8,24.29 13.9,24.39
  Bottom 0.254: INA219.7 INA219.8 | C14.1 19.6,19.1 20.1,18.6 | AP2112K.5 | AP2112K.5 22.95,17.75 24.23,16.48 INA219.7 | 24.2,15.62 INA219.7 | 22.9,13.02 INA219.4 | AP2112K.5 20.1,18.6 | 20.1,18.6 18.8,18.6 17.8,19.6 17.8,22.3 17.8,25 | R11.1 R10.1 18.15,25.35 17.8,25 | 24.2,15.58 INA219.7 | v23,11.2 22.93,11.28 INA219.4 | INA219.7 24.23,14.62 23.9,14.3 23.2,14.3 22.93,14.03 22.93,13.8 | 22.93,13.8 INA219.4 | U1.8 18.2,13.2 19.1,14.1 20.95,14.1 C8.1 22.57,14.15 22.93,13.8 | 14.5,13.2 13.64,13.2 R6.2 12.05,11.15 11.6,10.7 5.5,10.7 5.3,10.5 v5.3,8.6 4.8,8.1 4.8,5.4 4.65,5.25 RUNMODE_SWITCH.3 | 14.5,13.2 U1.8 | JP_FTDI.2 16.72,29.47 17.5,28.69 17.5,25.5 17.8,25.2 17.8,25 | R5.2 16.05,13.13 U1.8 | R18.1 11.85,18.35 12.5,17.7 13.7,17.7 14,17.4 v14,15.9 14,13.7 14.5,13.2
VCC_5V  (via drill 0.38)
  Top 0.254: 14.8,3.6 v14.7,3.6 15.2,3.6 16.1,4.5 TP13.TP
  Bottom 0.254: JP_MOTOR.2 15.46,1.52 15.46,2.86 15.44,2.86 v14.7,3.6 9.6,3.6 C1.1 | C1.1 8.6,6.3 9.4,6.3 | 9.4,6.3 MCP1640.5 | C2.1 R2.1 12.65,8.85 11.9,8.1 10,8.1 9.6,7.7 9.6,6.5 9.4,6.3 | C1.1 6.05,7.15 R14.1
VCHRG  (via drill 0.38)
  Top 0.254: v21.6,2.5 22.66,1.5 JP_VCHRG_IN.2 28.2,2.84 TP11.TP
  Bottom 0.254: R4.2 18.65,8.1 20.8,8.1 21.2,7.7 21.2,6.8 20.9,6.5 20.9,3.2 v21.6,2.5 21.4,2.7 | LED_CHRG.A JP_VCHRG_IN.2
  Bottom 0.305: 29.05,7.15 C5.2 | JP_VCHRG_IN.2 28.2,2.74 28.2,6.65 27.7,7.15
  Bottom 0.406: MCP73831.4 27.7,7.15 29.05,7.15
VIN
  Bottom 0.254: AP2112K.1 21.4,21.2 C13.1 | 24.85,20.75 AP2112K.3 24.85,20.15 24.5,19.8 23.9,19.8 | INA219.1
  Bottom 0.406: 25.5,12.4 25.5,16.3 23.9,17.9 23.9,19.8 23.3,19.8 22.95,20.15 AP2112K.1 22.95,20.75 | R8.2 25.8,10.9 | 25.6,11.1 R8.2 | INA219.1 25.5,12.4 | 25.5,12.4 25.9,12 R8.2
VSWITCH  (via drill 0.38)
  Top 0.254: v26.2,9.1 28.5,9.1 v28.7,9.3 28.7,9.8 TP10.TP
  Top 0.305: v28.7,9.3 28.7,7.9 28.3,7.5 20.5,7.5 v20.4,7.4
  Bottom 0.254: 15.25,5.35 L1.P$1 | v26.2,9.1 24.7,9.1 24.43,9.38 24.43,12.18 24.23,12.38 INA219.2 | 17.85,5.2 C3.2
  Bottom 0.305: MCP1640.6 11.15,7.25 11.5,6.9 11.5,5.1 11.85,4.75 14.05,4.75 14.5,5.2 L1.P$1 17.85,5.2 | v28.7,9.3 R8.1 | v20.4,7.4 18.45,5.45 C3.2
  Bottom 0.406: POWER_SWITCH.1 28.35,14.55 28.9,14 28.9,11 R8.1

### Text on the board
tPlace: TP6 | TP1 | RST | RST | VCC | GND | SDA | SCL | TX | RX | TP7 | FTDI | GND | TP8 | VBAT | TP9 | OFF | POWER | ON | FLASH | TP10 | BOOT / MODE | TP12 | TP14 | TP13 | RUN | MOTOR | TP11 | GND | VCC | VDD | GND | VChrg
bPlace: LED2 | RST | TX | RX | VCC | GND | RST / AT | SDA | GND | SCL | VBAT | OFF | U2 | AP2112K | 09112016 | v8.0 | IN219 | U1 | ATECC108 | FLASH | L1 | RUN | VCC | VDD | GND | VChrg | GND | GND
tDocu: Released under the Creative Commons Attribution Share-Alike 4.0 License / https://creativecommons.org/licenses/by-sa/4.0/ | Designed by: Daniel Pickem (http://www.danielpickem.com/) at the / GRITSLab at Georgia Tech (http://gritslab.gatech.edu)